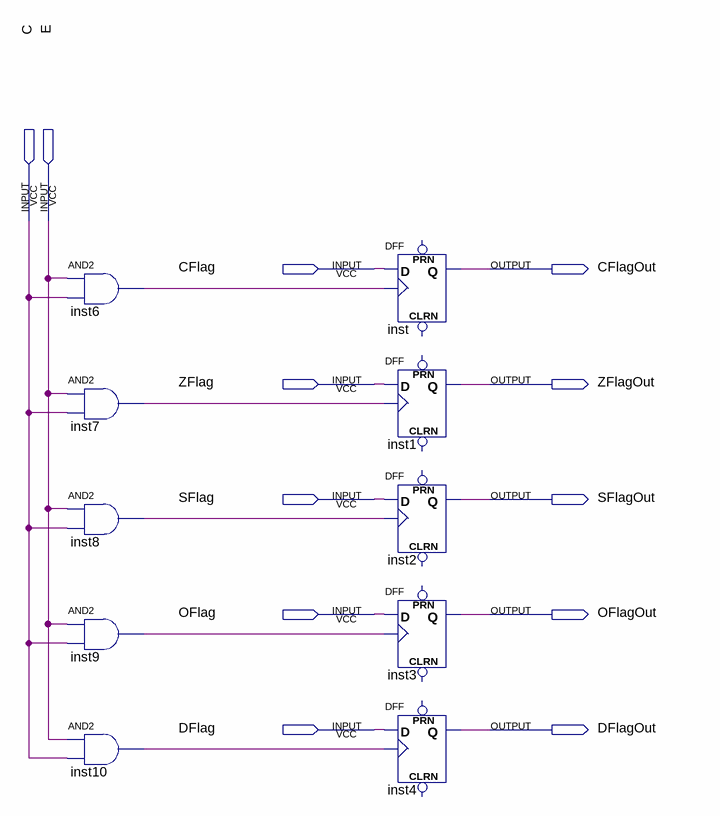
[diagram p0: schematic sheet]
// Quartus schematic FlagsRegister.bdf as structural Verilog: 10 symbols, 12 pins
module FlagsRegister (
  input  C,
  input  E,
  input  CFlag,
  input  ZFlag,
  input  SFlag,
  input  OFlag,
  input  DFlag,
  output CFlagOut,
  output ZFlagOut,
  output SFlagOut,
  output OFlagOut,
  output DFlagOut
);

  wire inst6_out, inst7_out, inst8_out, inst9_out, inst10_out;

  and inst6 (inst6_out, E, C);
  and inst7 (inst7_out, E, C);
  and inst8 (inst8_out, E, C);
  and inst9 (inst9_out, E, C);
  and inst10 (inst10_out, E, C);
  DFF inst (.CLK(inst6_out), .D(CFlag), .Q(CFlagOut));  // open: CLRN, PRN
  DFF inst1 (.CLK(inst7_out), .D(ZFlag), .Q(ZFlagOut));  // open: CLRN, PRN
  DFF inst2 (.CLK(inst8_out), .D(SFlag), .Q(SFlagOut));  // open: CLRN, PRN
  DFF inst3 (.CLK(inst9_out), .D(OFlag), .Q(OFlagOut));  // open: CLRN, PRN
  DFF inst4 (.CLK(inst10_out), .D(DFlag), .Q(DFlagOut));  // open: CLRN, PRN
endmodule
